# Altium schematic sheet MedicalSheet.SchDoc
size A4
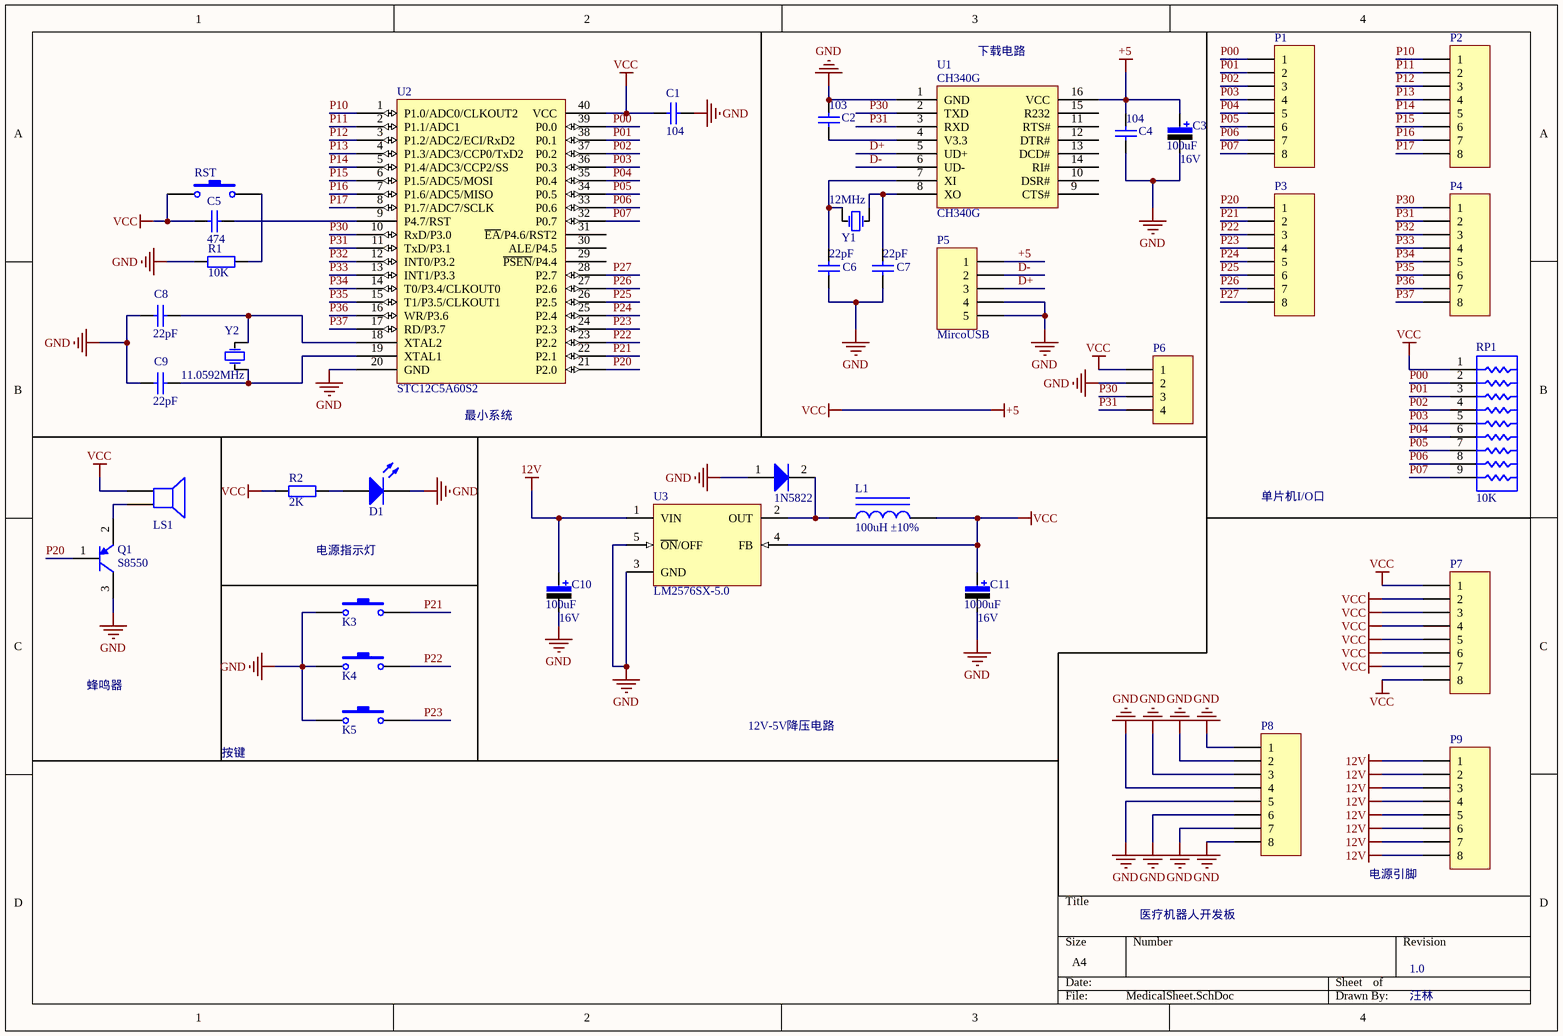
[diagram p0: MedicalSheet.SchDoc]

## Parts
1N5822  Diode_SMA_S  [SMA(DO-214AC)_S1]  (value not drawn)
C1  value 104  [C-RAD-0805]  (hidden comment: Cap)
C2  value 103  [C-RAD-0805]  (hidden comment: Cap)
C3  value 100uF  Vol: 16V  [C-RB-8]  (hidden comment: Cap Pol)
C4  value 104  [C-RAD-0805]  (hidden comment: Cap)
C5  value 474  [C-RAD-0805]  (hidden comment: Cap)
C6  value 22pF  [C-RAD-0805]  (hidden comment: Cap)
C7  value 22pF  [C-RAD-0805]  (hidden comment: Cap)
C8  value 22pF  [C-RAD-0805]  (hidden comment: Cap)
C9  value 22pF  [C-RAD-0805]  (hidden comment: Cap)
C10  value 100uF  Vol: 16V  [C-RB-8]  (hidden comment: Cap Pol)
C11  value 1000uF  Vol: 16V  [C-RB-8]  (hidden comment: Cap Pol)
D1  LED0  [LED3]  (value not drawn)
K3  Switch1  [SW_PB - 6.5x4.5]  (value not drawn)
K4  Switch1  [SW_PB - 6.5x4.5]  (value not drawn)
K5  Switch1  [SW_PB - 6.5x4.5]  (value not drawn)
L1  100uH ±10%  [0805_L]
LS1  SPEAKER  [Beep]  (value not drawn)
P1  Header 8  [SIP8 - duplicate]  (value not drawn)
P2  Header 8  [SIP8 - duplicate]  (value not drawn)
P3  Header 8  [SIP8 - duplicate]  (value not drawn)
P4  Header 8  [SIP8 - duplicate]  (value not drawn)
P5  MircoUSB  [MircoUSB]
P6  Header 4  [HDR4X1_A]  (value not drawn)
P7  Header 8  [SIP8 - duplicate]  (value not drawn)
P8  Header 8  [SIP8 - duplicate]  (value not drawn)
P9  Header 8  [SIP8 - duplicate]  (value not drawn)
Q1  S8550  [SOT-23]
R1  value 10K  [0805-1]  (hidden comment: Res1)
R2  value 2K  [0805-1]  (hidden comment: Res1)
RP1  10K  [SIP9 - duplicate]
RST  Switch1  [SW_PB - 6.5x4.5]  (value not drawn)
U1  CH340G  [SOIC-16_150mil]
U2  STC12C5A60S2  [DIP-40]
U3  LM2576SX-5.0  [TO-263-5]
Y1  value 12MHz  [XTAL1]  (hidden comment: XTAL)
Y2  value 11.0592MHz  [XTAL1]  (hidden comment: XTAL)

## Nets
12V: C10.1 P9.1 P9.2 P9.3 P9.4 P9.5 P9.6 P9.7 P9.8 U3.1(VIN)
+5: C1.1 C3.1 C4.2 C5.1 C11.1 L1.2 LS1.1 P5.1 P6.1 P7.1 P7.2 P7.3 P7.4 P7.5 P7.6 P7.7 P7.8 R2.1 RP1.1 RST.1 U1.16(VCC) U2.40(VCC) U3.4(FB)  [also labelled VCC]
GND: 1N5822.1(A) C1.2 C2.2 C3.2 C4.1 C6.1 C7.1 C8.1 C9.1 C10.2 C11.2 D1.K K3.1 K4.1 K5.1 P5.4 P5.5 P6.2 P8.1 P8.2 P8.3 P8.4 P8.5 P8.6 P8.7 P8.8 Q1.3(C) R1.1 U1.1(GND) U2.20(GND) U3.3(GND) U3.5(~{ON}/OFF)
D+: P5.3 U1.5(UD+)
D-: P5.2 U1.6(UD-)
P00: P1.1 RP1.2 U2.39(P0.0)
P01: P1.2 RP1.3 U2.38(P0.1)
P02: P1.3 RP1.4 U2.37(P0.2)
P03: P1.4 RP1.5 U2.36(P0.3)
P04: P1.5 RP1.6 U2.35(P0.4)
P05: P1.6 RP1.7 U2.34(P0.5)
P06: P1.7 RP1.8 U2.33(P0.6)
P07: P1.8 RP1.9 U2.32(P0.7)
P10: P2.1 U2.1(P1.0/ADC0/CLKOUT2)
P11: P2.2 U2.2(P1.1/ADC1)
P12: P2.3 U2.3(P1.2/ADC2/ECI/RxD2)
P13: P2.4 U2.4(P1.3/ADC3/CCP0/TxD2)
P14: P2.5 U2.5(P1.4/ADC3/CCP2/SS)
P15: P2.6 U2.6(P1.5/ADC5/MOSI)
P16: P2.7 U2.7(P1.6/ADC5/MISO)
P17: P2.8 U2.8(P1.7/ADC7/SCLK)
P20: P3.1 Q1.1(B) U2.21(P2.0)
P21: K3.2 P3.2 U2.22(P2.1)
P22: K4.2 P3.3 U2.23(P2.2)
P23: K5.2 P3.4 U2.24(P2.3)
P24: P3.5 U2.25(P2.4)
P25: P3.6 U2.26(P2.5)
P26: P3.7 U2.27(P2.6)
P27: P3.8 U2.28(P2.7)
P30: P4.1 P6.3 U1.2(TXD) U2.10(RxD/P3.0)
P31: P4.2 P6.4 U1.3(RXD) U2.11(TxD/P3.1)
P32: P4.3 U2.12(INT0/P3.2)
P33: P4.4 U2.13(INT1/P3.3)
P34: P4.5 U2.14(T0/P3.4/CLKOUT0)
P35: P4.6 U2.15(T1/P3.5/CLKOUT1)
P36: P4.7 U2.16(WR/P3.6)
P37: P4.8 U2.17(RD/P3.7)
Net1N5822_2: 1N5822.2(K) L1.1 U3.2(OUT)
NetC2_1: C2.1 U1.4(V3.3)
NetC5_2: C5.2 U2.9(P4.7/RST)
NetC6_2: C6.2 U1.7(XI) Y1.2(OSC2)
NetC7_2: C7.2 U1.8(XO) Y1.1(OSC1)
NetC8_2: C8.2 U2.18(XTAL2) Y2.2(OSC2)
NetC9_2: C9.2 U2.19(XTAL1) Y2.1(OSC1)
NetD1_A: D1.A R2.2
NetLS1_2: LS1.2 Q1.2(E)
NetR1_2: R1.2 RST.2

Not connected (* = marked no-connect by the designer): U1 9(CTS#) 10(DSR#) 11(RTS#) 12(DTR#) 13(DCD#) 14(RI#) 15(R232); U2 29(~{PSEN}/P4.4) 30(ALE/P4.5) 31(~{EA}/P4.6/RST2)

## Notes on the sheet
- (near U1) 下载电路
- (near U2) 最小系统
- 单片机I/O口
- 电源指示灯
- 蜂鸣器
- 按键
- 12V-5V降压电路
- 医疗机器人开发板
- 电源引脚
- 1.0
- 汪林

## Library data of the parts
1N5822 = Diode_SMA_S: SMA; Revision: July-2002: Re-released for DXP Platform.; 封装区别: https://blog.csdn.net/penglijiang/article/details/16279269
C1 C2 C4-C9 = Cap: 无极性电容; Published: 8-Jun-2000; LatestRevisionDate: 17-Jul-2002; LatestRevisionNote: Re-released for DXP Platform.; PackageReference: RAD-0.3; Publisher: Altium Limited
C3 C10 C11 = Cap Pol: 极性电解电容; Published: 8-Jun-2000; LatestRevisionDate: 17-Jul-2002; LatestRevisionNote: Re-released for DXP Platform.; PackageReference: RB7.6-15; Publisher: Altium Limited
D1 = LED0: 发光二极管; Published: 8-Jun-2000; LatestRevisionDate: 08-Jul-2005; LatestRevisionNote: Mech Layer 1 removed.; PackageReference: LED-0; Publisher: Altium Limited
K3-K5 RST = Switch1: 按键/单刀单掷开关
L1 = 0805 100uH 10%: 贴片电感; ComponentLink1Description: 供应商链接; ComponentLink1URL: http://www.szlcsc.com/product/details_69137.html; Package: 0805; Supplier: LC; SuppliersPartNumber: C68035
P1-P4 P7-P9 = Header 8: 8PIN
P5 = Header 5: 5PIN
P6 = Header 4: 接插件; LatestRevisionDate: 17-Jul-2002; LatestRevisionNote: Re-released for DXP Platform.; Publisher: Altium Limited
Q1 = SS8550: PNP贴片三极管; Published: 8-Jun-2000; LatestRevisionDate: 15-Jan-2003; LatestRevisionNote: PCB Footprint 'BCY-W3/D4.7' replaced; DatasheetDocument: 1997; PackageDocument: Sep-1998; PackageReference: TO-92A; Publisher: Altium Limited; Code_JEDEC: TO-92A; ComponentLink1Description: Manufacturer Link; ComponentLink1URL: http://www.fairchildsemi.com/; ComponentLink2Description: Datasheet; ComponentLink2URL: http://www.fairchildsemi.com/ds/2N%2F2N3906.pdf
R1 R2 = Res1: 贴片电阻; Published: 8-Jun-2000; LatestRevisionDate: 17-Jul-2002; LatestRevisionNote: Re-released for DXP Platform.; PackageReference: AXIAL-0.4; Publisher: Altium Limited
RP1 = Res Pack2: 9PIN排阻; Value: *
U1 = CH340G: USB; ComponentLink1Description: 供应商链接; ComponentLink1URL: http://www.szlcsc.com/product/details_14927.html; Package: SOIC-16_150mil; Supplier: LC; SuppliersPartNumber: C14267
U2 = STC12C5A60S2_DIP
U3 = LM2576SX-5.0: DC-DC芯片; ComponentLink1Description: 供应商链接; ComponentLink1URL: http://www.szlcsc.com/product/details_35434.html; Package: TO-263-5; Supplier: LC; SuppliersPartNumber: C34465
Y1 Y2 = XTAL: 晶振; Published: 8-Jun-2000; LatestRevisionDate: 17-Jul-2002; LatestRevisionNote: Re-released for DXP Platform.; PackageReference: R38; Publisher: Altium Limited